# Altium schematic sheet SDCARD_FLASH.SchDoc
size B
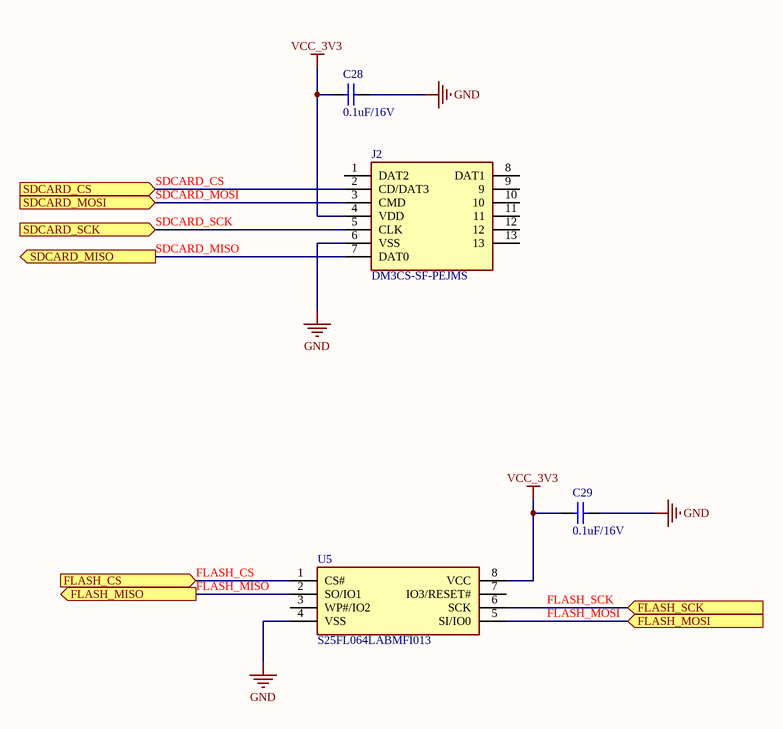
[diagram p0: SDCARD_FLASH.SchDoc]

## Parts
C28  0.1uF/16V  [RAD-0.3]
C29  0.1uF/16V  [RAD-0.3]
J2  DM3CS-SF-PEJMS  [DM3CSSFPEJMS]
U5  S25FL064LABMFI013  [SOIC127P800X216-8N]

## Ports
FLASH_CS (in), FLASH_MISO (out), FLASH_MOSI (in), FLASH_SCK (in), SDCARD_CS (in), SDCARD_MISO (out), SDCARD_MOSI (in), SDCARD_SCK (in)

## Nets
GND: C28.1 C29.1 J2.6(VSS) U5.4(VSS)
VCC_3V3: C28.2 C29.2 J2.4(VDD) U5.8(VCC)
FLASH_CS: U5.1(CS#) ; port FLASH_CS
FLASH_MISO: U5.2(SO/IO1) ; port FLASH_MISO
FLASH_MOSI: U5.5(SI/IO0) ; port FLASH_MOSI
FLASH_SCK: U5.6(SCK) ; port FLASH_SCK
SDCARD_CS: J2.2(CD/DAT3) ; port SDCARD_CS
SDCARD_MISO: J2.7(DAT0) ; port SDCARD_MISO
SDCARD_MOSI: J2.3(CMD) ; port SDCARD_MOSI
SDCARD_SCK: J2.5(CLK) ; port SDCARD_SCK

Not connected (* = marked no-connect by the designer): J2 1(DAT2) 8(DAT1) 9 10 11 12 13; U5 3(WP#/IO2) 7(IO3/RESET#)

## Library data of the parts
C28 C29 = Cap: Capacitor; Published: 8-Jun-2000; LatestRevisionDate: 17-Jul-2002; LatestRevisionNote: Re-released for DXP Platform.; PackageReference: RAD-0.3; Publisher: Altium Limited; PackageDescription: Radial Cap, Thru-Hole; 2 Leads; 0.3 in Pin Spacing; Value: 0.1uF/16V
J2 = DM3CS-SF-PEJMS: Connector; Manufacturer_Name: Hirose; Datasheet Link: https://www.hirose.com/product/en/download_file/key_name/DM3/category/Catalog/doc_file_id/49662/?file_category_id=4&item_id=195&is_series=1; Height: 1.83mm; Manufacturer_Part_Number: DM3CS-SF-PEJMS
U5 = S25FL064LABMFI013: Integrated Circuit; Manufacturer_Name: Cypress Semiconductor; Datasheet Link: http://www.cypress.com/file/316661/download; Height: 2.16mm; Manufacturer_Part_Number: S25FL064LABMFI013; Arrow Part Number: S25FL064LABMFI013; Arrow Price/Stock: https://www.arrow.com/en/products/s25fl064labmfi013/cypress-semiconductor; Mouser Part Number: 727-S25FL064LAMFI013; Mouser Price/Stock: https://www.mouser.co.uk/ProductDetail/Cypress-Semiconductor/S25FL064LABMFI013?qs=u4fy%2FsgLU9PtvO%252BABYRiUQ%3D%3D